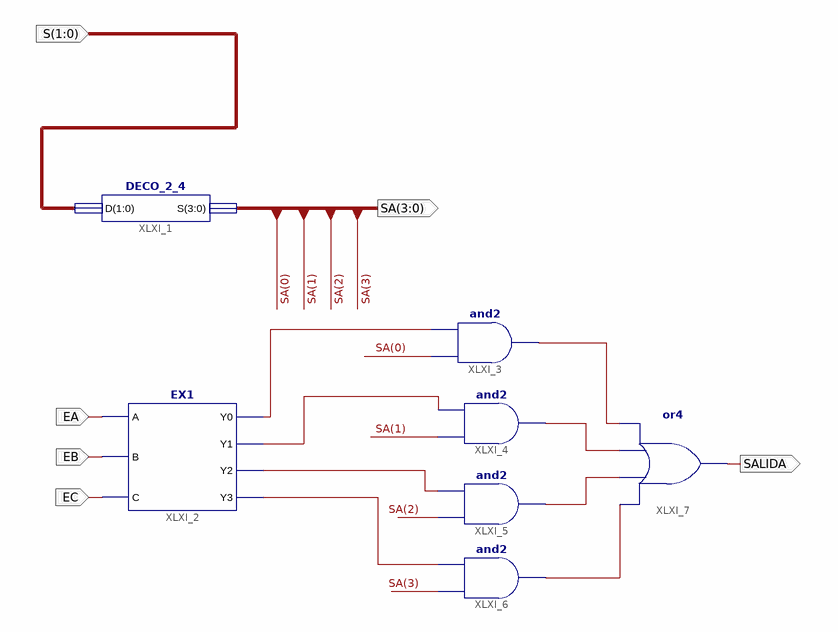
[diagram p0: schematic sheet 1]
// Xilinx ISE schematic FINAL.sch (spartan3e) as structural Verilog: 7 symbols, 6 ports
module FINAL (
  input  [1:0] S,
  input  EA,
  input  EB,
  input  EC,
  output [3:0] SA,
  output SALIDA
);

  wire XLXN_9, XLXN_10, XLXN_11, XLXN_12, XLXN_13, XLXN_15, XLXN_17, XLXN_18;

  DECO_2_4 XLXI_1 (.D(S), .S(SA));
  EX1 XLXI_2 (.A(EA), .B(EB), .C(EC), .Y0(XLXN_13), .Y1(XLXN_15), .Y2(XLXN_17), .Y3(XLXN_18));
  and XLXI_3 (XLXN_9, SA[0], XLXN_13);
  and XLXI_4 (XLXN_10, SA[1], XLXN_15);
  and XLXI_5 (XLXN_12, SA[2], XLXN_17);
  and XLXI_6 (XLXN_11, SA[3], XLXN_18);
  or XLXI_7 (SALIDA, XLXN_11, XLXN_12, XLXN_10, XLXN_9);
endmodule
